# Altium project PWM controller.PrjPcb
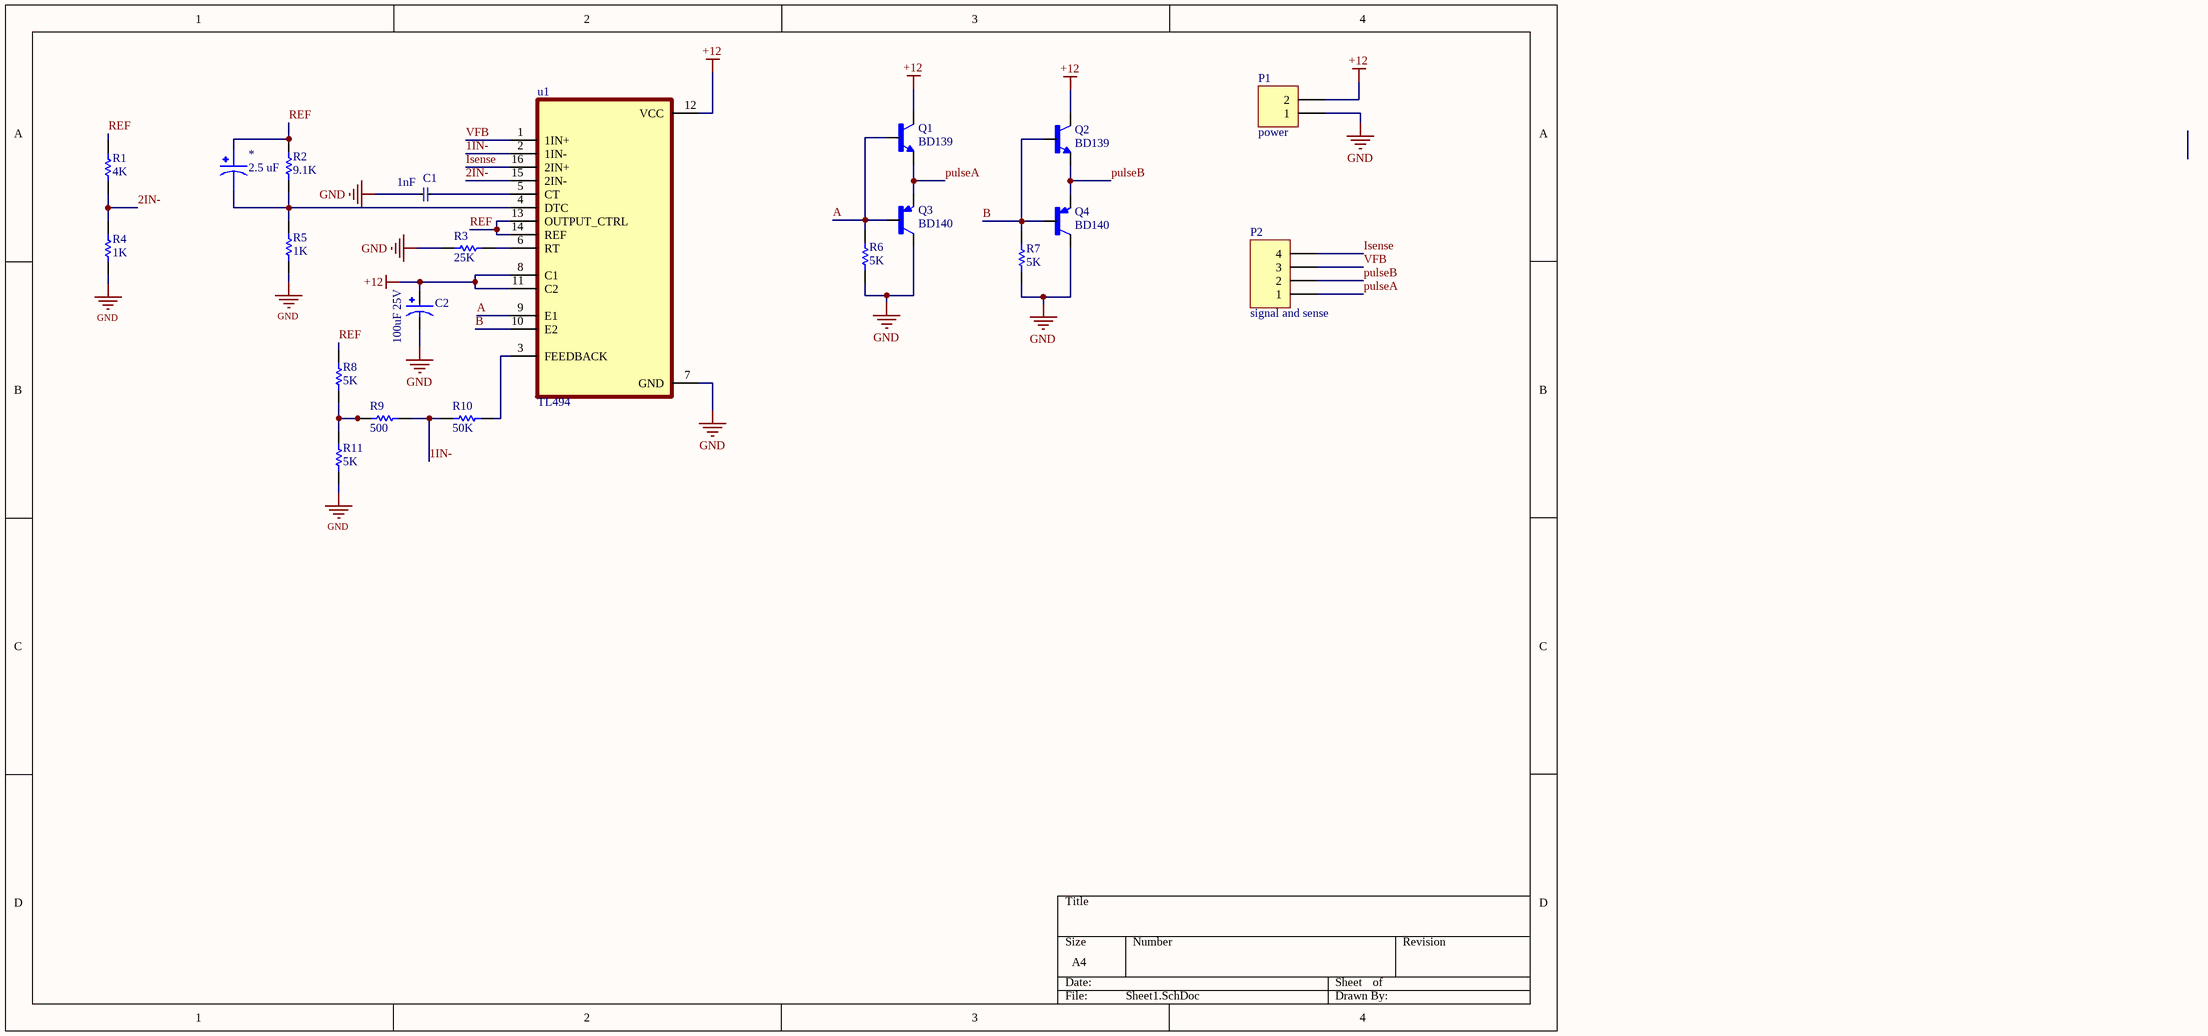
[diagram p0: Sheet1.SchDoc]
1 sheet, 21 parts. Net scope: global (net labels, ports and power ports of the same name join across sheets).
Board file: PCB1.PcbDoc

## Sheet Sheet1.SchDoc
size A4; SheetNumber: 1; SheetTotal: 1

### Parts
*  2.5 uF  [CAPPRD200W50D550H1250 - duplicate]
C1  1nF  [ceramic capacitor]
C2  100uF 25V  [CAPPRD250W50D630H1120]
P1  power  [HDR1X2H]
P2  signal and sense  [HDR1X4H]
Q1  BD139  [TO229P780X300X1364-3 - duplicate]
Q2  BD139  [TO229P780X300X1364-3 - duplicate]
Q3  BD140  [TO229P760X270X1364-3]
Q4  BD140  [TO229P760X270X1364-3]
R1  value 4K  [AXIAL-0.3]
R2  value 9.1K  [AXIAL-0.3]
R3  value 25K  [AXIAL-0.3]
R4  value 1K  [AXIAL-0.3]
R5  value 1K  [AXIAL-0.3]
R6  value 5K  [AXIAL-0.3]
R7  value 5K  [AXIAL-0.3]
R8  value 5K  [AXIAL-0.3]
R9  value 500  [AXIAL-0.3]
R10  value 50K  [AXIAL-0.3]
R11  value 5K  [AXIAL-0.3]
u1  TL494  [DIP-16]

### Nets
+12: C2.P P1.2 Q1.2(C) Q2.2(C) u1.8(C1) u1.11(C2) u1.12(VCC)
GND: C1.1 C2.N P1.1 Q3.2(C) Q4.2(C) R3.1 R4.1 R5.1 R6.1 R7.1 R11.1 u1.7(GND)
1IN-: R9.2 R10.1 u1.2(1IN-)
2IN-: R1.1 R4.2 u1.15(2IN-)
A: Q1.1(B) Q3.3(B) R6.2 u1.9(E1)
B: Q2.1(B) Q4.3(B) R7.2 u1.10(E2)
Isense: P2.4 u1.16(2IN+)
pulseA: P2.1 Q1.3(E) Q3.1(E)
pulseB: P2.2 Q2.3(E) Q4.1(E)
REF: *.1 R1.2 R2.2 R8.2 u1.13(OUTPUT_CTRL) u1.14(REF)
VFB: P2.3 u1.1(1IN+)
Net*_2: *.2 R2.1 R5.2 u1.4(DTC)
NetC1_2: C1.2 u1.5(CT)
NetR3_2: R3.2 u1.6(RT)
NetR8_1: R8.1 R9.1 R11.2
NetR10_2: R10.2 u1.3(FEEDBACK)

### Library data of the parts
C1 = ceramic cpaccitor
P1 = Header 2H: Header, 2-Pin, Right Angle; LatestRevisionDate: 17-Jul-2002; LatestRevisionNote: Re-released for DXP Platform.; Publisher: Altium Limited
P2 = Header 4H: Header, 4-Pin, Right Angle; LatestRevisionDate: 17-Jul-2002; LatestRevisionNote: Re-released for DXP Platform.; Publisher: Altium Limited
R1-R11 = Res1: Resistor; Published: 8-Jun-2000; LatestRevisionDate: 17-Jul-2002; LatestRevisionNote: Re-released for DXP Platform.; PackageReference: AXIAL-0.3; Publisher: Altium Limited; PackageDescription: Axial Device, Thru-Hole; 2 Leads; 0.3 in Pin Spacing
u1 = TL494: IC: PWM Controllar